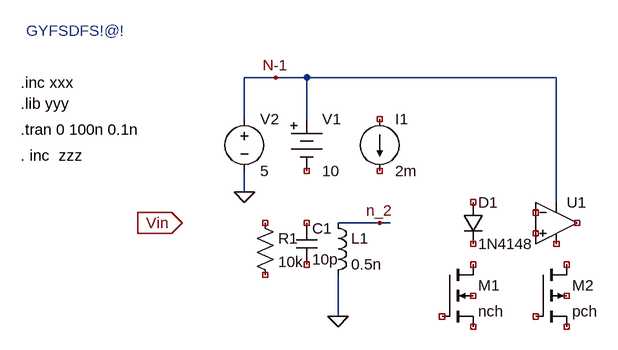
[diagram p0: schematic Draft1.asc]
Draft1.asc, the LTspice schematic file:
Version 4
SHEET 1 880 680
WIRE -64 32 -112 32
WIRE -16 32 -64 32
WIRE 368 32 -16 32
WIRE -112 96 -112 32
WIRE -16 96 -16 32
WIRE -112 208 -112 176
WIRE 368 224 368 32
WIRE 96 256 32 256
WIRE 112 256 96 256
WIRE 32 400 32 336
FLAG -112 208 0
FLAG 32 400 0
FLAG -64 32 N-1
FLAG 96 256 n_2
FLAG -208 256 Vin
IOPIN -208 256 In
SYMBOL Misc\\battery -16 80 R0
WINDOW 123 0 0 Left 2
WINDOW 39 0 0 Left 2
SYMATTR InstName V1
SYMATTR Value 10
SYMBOL Opamps\\UniversalOpamp2 368 256 R0
SYMATTR InstName U1
SYMBOL cap -32 256 R0
SYMATTR InstName C1
SYMATTR Value 10p
SYMBOL current 96 96 R0
WINDOW 123 0 0 Left 2
WINDOW 39 0 0 Left 2
SYMATTR InstName I1
SYMATTR Value 2m
SYMBOL diode 224 224 R0
SYMATTR InstName D1
SYMATTR Value 1N4148
SYMBOL ind 16 240 R0
SYMATTR InstName L1
SYMATTR Value 0.5n
SYMBOL nmos4 192 320 R0
SYMATTR InstName M1
SYMATTR Value nch
SYMATTR Value2 l=0.18u w=5u
SYMBOL pmos4 336 320 R0
SYMATTR InstName M2
SYMATTR Value pch
SYMATTR Value2 l=0.18u w=10u
SYMBOL res -96 240 R0
SYMATTR InstName R1
SYMATTR Value 10k
SYMBOL voltage -112 80 R0
WINDOW 123 0 0 Left 2
WINDOW 39 0 0 Left 2
SYMATTR InstName V2
SYMATTR Value 5
TEXT -448 -40 Left 2 ;GYFSDFS!@!
TEXT -456 72 Left 2 !.lib yyy
TEXT -456 40 Left 2 !.inc xxx
TEXT -456 112 Left 2 !.tran 0 100n 0.1n
TEXT -456 152 Left 2 !. inc  zzz

The netlist it stands for:
* Draft1.asc
V1 N-1 NC_01 10
XU1 NC_02 NC_03 N-1 NC_04 NC_05 level.2 Avol=1Meg GBW=10Meg Slew=10Meg ilimit=25m rail=0 Vos=0 phimargin=45 en=0 enk=0 in=0 ink=0 Rin=500Meg  ; pins IN+ IN- V+ V- OUT
C1 NC_06 NC_07 10p
I1 NC_08 NC_09 2m
D1 NC_10 NC_11 1N4148
L1 n_2 0 0.5n
M1 NC_12 NC_13 NC_14 NC_15 nch l=0.18u w=5u
M2 NC_16 NC_17 NC_18 NC_19 pch l=0.18u w=10u
R1 NC_20 NC_21 10k
V2 N-1 0 5
.model D D
.lib standard.dio
.model NMOS NMOS
.model PMOS PMOS
.lib standard.mos
* GYFSDFS!@!
.lib yyy
.inc xxx
.tran 0 100n 0.1n
. inc  zzz
.lib UniversalOpamps2.sub
.backanno
.end